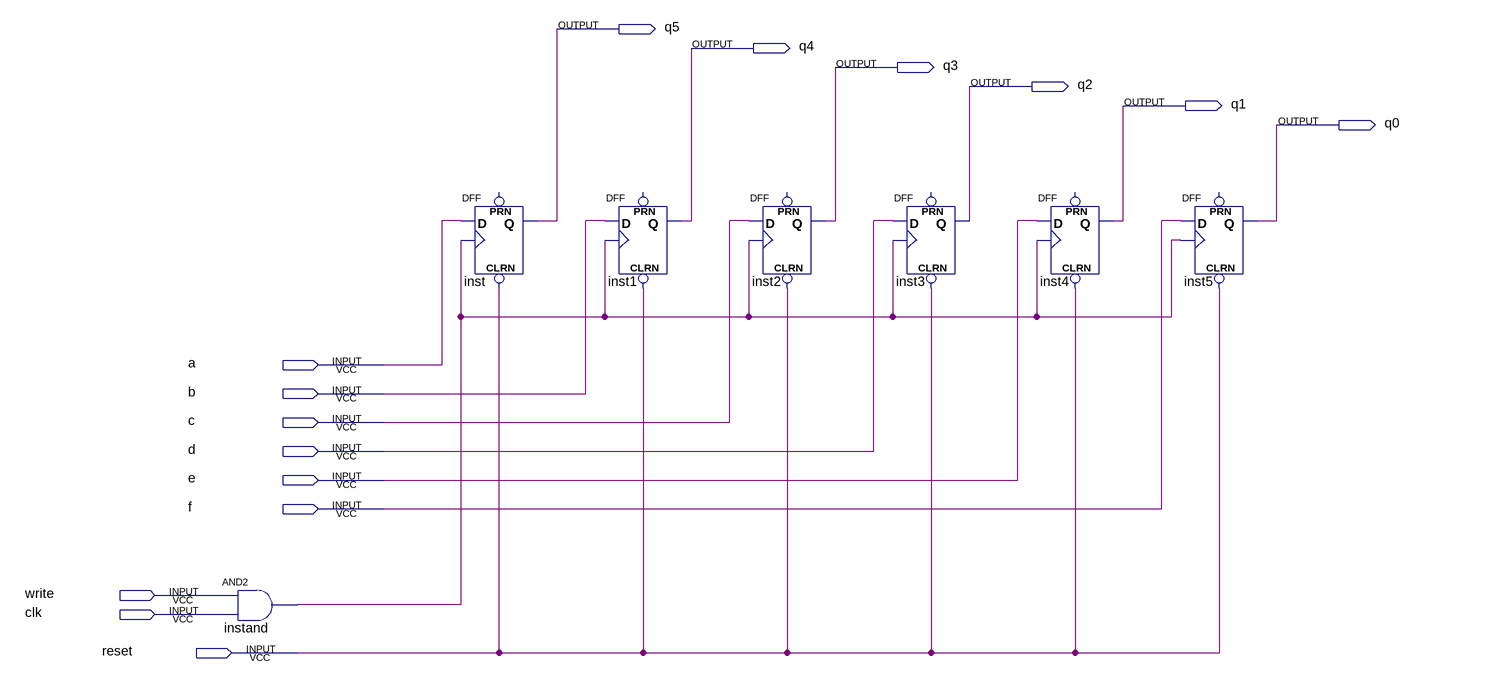
[diagram p0: schematic sheet]
// Quartus schematic recordador.bdf as structural Verilog: 7 symbols, 15 pins
module recordador (
  input  a,
  input  b,
  input  c,
  input  d,
  input  e,
  input  f,
  input  write,
  input  clk,
  input  reset,
  output q5,
  output q4,
  output q3,
  output q2,
  output q1,
  output q0
);

  wire instand_out;

  and instand (instand_out, write, clk);
  DFF inst (.CLRN(reset), .CLK(instand_out), .D(a), .Q(q5));  // open: PRN
  DFF inst1 (.CLRN(reset), .CLK(instand_out), .D(b), .Q(q4));  // open: PRN
  DFF inst2 (.CLRN(reset), .CLK(instand_out), .D(c), .Q(q3));  // open: PRN
  DFF inst3 (.CLRN(reset), .CLK(instand_out), .D(d), .Q(q2));  // open: PRN
  DFF inst4 (.CLRN(reset), .CLK(instand_out), .D(e), .Q(q1));  // open: PRN
  DFF inst5 (.CLRN(reset), .CLK(instand_out), .D(f), .Q(q0));  // open: PRN
endmodule
